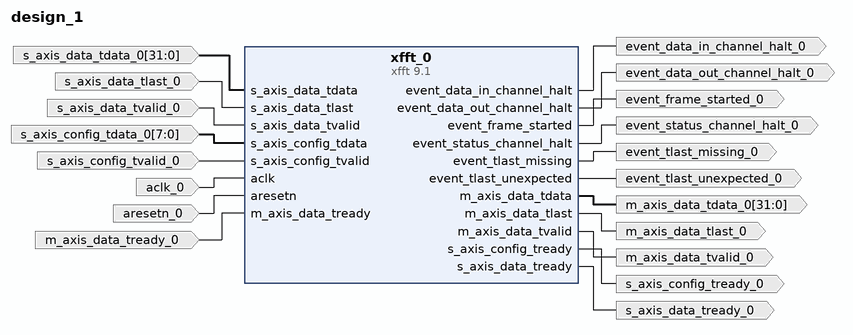
[diagram p0: block diagram of the top level]
# Vivado block design design_1, xc7a100tcsg324-1, Vivado 2018.3.1
create_bd_design design_1

create_bd_port -dir I -from 31 -to 0 s_axis_data_tdata_0
create_bd_port -dir I s_axis_data_tlast_0
create_bd_port -dir O s_axis_data_tready_0
create_bd_port -dir I s_axis_data_tvalid_0
create_bd_port -dir I -from 7 -to 0 s_axis_config_tdata_0
create_bd_port -dir O s_axis_config_tready_0
create_bd_port -dir I s_axis_config_tvalid_0
create_bd_port -dir I -type clk aclk_0
create_bd_port -dir I -type rst aresetn_0
create_bd_port -dir O -from 31 -to 0 m_axis_data_tdata_0
create_bd_port -dir O m_axis_data_tlast_0
create_bd_port -dir I m_axis_data_tready_0
create_bd_port -dir O m_axis_data_tvalid_0
create_bd_port -dir O -type intr event_frame_started_0
create_bd_port -dir O -type intr event_tlast_unexpected_0
create_bd_port -dir O -type intr event_tlast_missing_0
create_bd_port -dir O -type intr event_status_channel_halt_0
create_bd_port -dir O -type intr event_data_in_channel_halt_0
create_bd_port -dir O -type intr event_data_out_channel_halt_0

create_bd_cell -type ip -vlnv xilinx.com:ip:xfft:9.1 xfft_0
set_property -dict [list \
  CONFIG.aresetn true \
  CONFIG.butterfly_type use_luts \
  CONFIG.implementation_options pipelined_streaming_io \
  CONFIG.input_width 9 \
  CONFIG.number_of_stages_using_block_ram_for_data_and_phase_factors 0 \
  CONFIG.output_ordering natural_order \
  CONFIG.rounding_modes truncation \
  CONFIG.scaling_options unscaled \
  CONFIG.target_clock_frequency 100 \
  CONFIG.target_data_throughput 50 \
  CONFIG.transform_length 64 \
] [get_bd_cells xfft_0]

# ---- connections ----

connect_bd_net -net s_axis_data_tdata_0_1 [get_bd_ports s_axis_data_tdata_0] [get_bd_pins xfft_0/s_axis_data_tdata]
connect_bd_net -net s_axis_data_tlast_0_1 [get_bd_ports s_axis_data_tlast_0] [get_bd_pins xfft_0/s_axis_data_tlast]
connect_bd_net [get_bd_pins xfft_0/s_axis_data_tready] [get_bd_ports s_axis_data_tready_0]
connect_bd_net -net s_axis_data_tvalid_0_1 [get_bd_ports s_axis_data_tvalid_0] [get_bd_pins xfft_0/s_axis_data_tvalid]
connect_bd_net -net s_axis_config_tdata_0_1 [get_bd_ports s_axis_config_tdata_0] [get_bd_pins xfft_0/s_axis_config_tdata]
connect_bd_net [get_bd_pins xfft_0/s_axis_config_tready] [get_bd_ports s_axis_config_tready_0]
connect_bd_net -net s_axis_config_tvalid_0_1 [get_bd_ports s_axis_config_tvalid_0] [get_bd_pins xfft_0/s_axis_config_tvalid]
connect_bd_net -net aclk_0_1 [get_bd_ports aclk_0] [get_bd_pins xfft_0/aclk]
connect_bd_net -net aresetn_0_1 [get_bd_ports aresetn_0] [get_bd_pins xfft_0/aresetn]
connect_bd_net [get_bd_pins xfft_0/m_axis_data_tdata] [get_bd_ports m_axis_data_tdata_0]
connect_bd_net [get_bd_pins xfft_0/m_axis_data_tlast] [get_bd_ports m_axis_data_tlast_0]
connect_bd_net -net m_axis_data_tready_0_1 [get_bd_ports m_axis_data_tready_0] [get_bd_pins xfft_0/m_axis_data_tready]
connect_bd_net [get_bd_pins xfft_0/m_axis_data_tvalid] [get_bd_ports m_axis_data_tvalid_0]
connect_bd_net [get_bd_pins xfft_0/event_frame_started] [get_bd_ports event_frame_started_0]
connect_bd_net [get_bd_pins xfft_0/event_tlast_unexpected] [get_bd_ports event_tlast_unexpected_0]
connect_bd_net [get_bd_pins xfft_0/event_tlast_missing] [get_bd_ports event_tlast_missing_0]
connect_bd_net [get_bd_pins xfft_0/event_status_channel_halt] [get_bd_ports event_status_channel_halt_0]
connect_bd_net [get_bd_pins xfft_0/event_data_in_channel_halt] [get_bd_ports event_data_in_channel_halt_0]
connect_bd_net [get_bd_pins xfft_0/event_data_out_channel_halt] [get_bd_ports event_data_out_channel_halt_0]

validate_bd_design
save_bd_design
